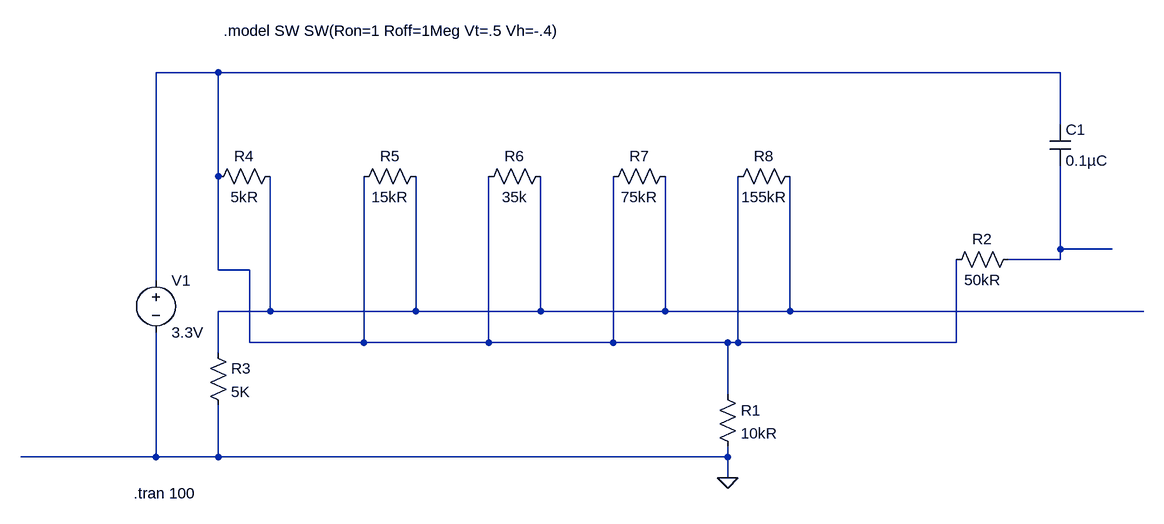
[diagram p0: schematic buttons.asc]
buttons.asc, the LTspice schematic file:
Version 4
SHEET 1 880 680
WIRE -576 -320 -672 -320
WIRE 720 -320 -576 -320
WIRE 720 -240 720 -320
WIRE -576 -160 -576 -320
WIRE 720 -48 720 -176
WIRE 800 -48 720 -48
WIRE 720 -32 720 -48
WIRE 720 -32 640 -32
WIRE -576 -16 -576 -160
WIRE -528 -16 -576 -16
WIRE -672 0 -672 -320
WIRE -496 48 -496 -160
WIRE -496 48 -576 48
WIRE -272 48 -272 -160
WIRE -272 48 -496 48
WIRE -80 48 -80 -160
WIRE -80 48 -272 48
WIRE 112 48 112 -160
WIRE 112 48 -80 48
WIRE 304 48 304 -160
WIRE 304 48 112 48
WIRE 848 48 304 48
WIRE -528 96 -528 -16
WIRE -352 96 -352 -160
WIRE -352 96 -528 96
WIRE -160 96 -160 -160
WIRE -160 96 -352 96
WIRE 32 96 32 -160
WIRE 32 96 -160 96
WIRE 208 96 32 96
WIRE 224 96 224 -160
WIRE 224 96 208 96
WIRE 560 96 560 -32
WIRE 560 96 224 96
WIRE -576 112 -576 48
WIRE 208 176 208 96
WIRE -672 272 -672 80
WIRE -672 272 -880 272
WIRE -576 272 -576 192
WIRE -576 272 -672 272
WIRE 208 272 208 256
WIRE 208 272 -576 272
WIRE 208 304 208 272
FLAG 208 304 0
SYMBOL res 192 160 R0
SYMATTR InstName R1
SYMATTR Value 10kR
SYMBOL voltage -672 -16 R0
WINDOW 123 0 0 Left 0
WINDOW 39 0 0 Left 0
SYMATTR InstName V1
SYMATTR Value 3.3V
SYMBOL cap 704 -240 R0
SYMATTR InstName C1
SYMATTR Value 0.1µC
SYMBOL res 656 -48 R90
WINDOW 0 0 56 VBottom 2
WINDOW 3 32 56 VTop 2
SYMATTR InstName R2
SYMATTR Value 50kR
SYMBOL res -592 96 R0
SYMATTR InstName R3
SYMATTR Value 5K
SYMBOL res -480 -176 R90
WINDOW 0 0 56 VBottom 2
WINDOW 3 32 56 VTop 2
SYMATTR InstName R4
SYMATTR Value 5kR
SYMBOL res -256 -176 R90
WINDOW 0 0 56 VBottom 2
WINDOW 3 32 56 VTop 2
SYMATTR InstName R5
SYMATTR Value 15kR
SYMBOL res -64 -176 R90
WINDOW 0 0 56 VBottom 2
WINDOW 3 32 56 VTop 2
SYMATTR InstName R6
SYMATTR Value 35k
SYMBOL res 128 -176 R90
WINDOW 0 0 56 VBottom 2
WINDOW 3 32 56 VTop 2
SYMATTR InstName R7
SYMATTR Value 75kR
SYMBOL res 320 -176 R90
WINDOW 0 0 56 VBottom 2
WINDOW 3 32 56 VTop 2
SYMATTR InstName R8
SYMATTR Value 155kR
TEXT -706 328 Left 2 !.tran 100
TEXT -568 -384 Left 2 !.model SW SW(Ron=1 Roff=1Meg Vt=.5 Vh=-.4)

The netlist it stands for:
* buttons.asc
R1 N001 0 10kR
V1 N001 0 3.3V
C1 N001 N002 0.1µC
R2 N002 N001 50kR
R3 N003 0 5K
R4 N003 N001 5kR
R5 N003 N001 15kR
R6 N003 N001 35k
R7 N003 N001 75kR
R8 N003 N001 155kR
.tran 100
.model SW SW(Ron=1 Roff=1Meg Vt=.5 Vh=-.4)
.backanno
.end